# Altium project MQ_V1.0.0.PrjPcb
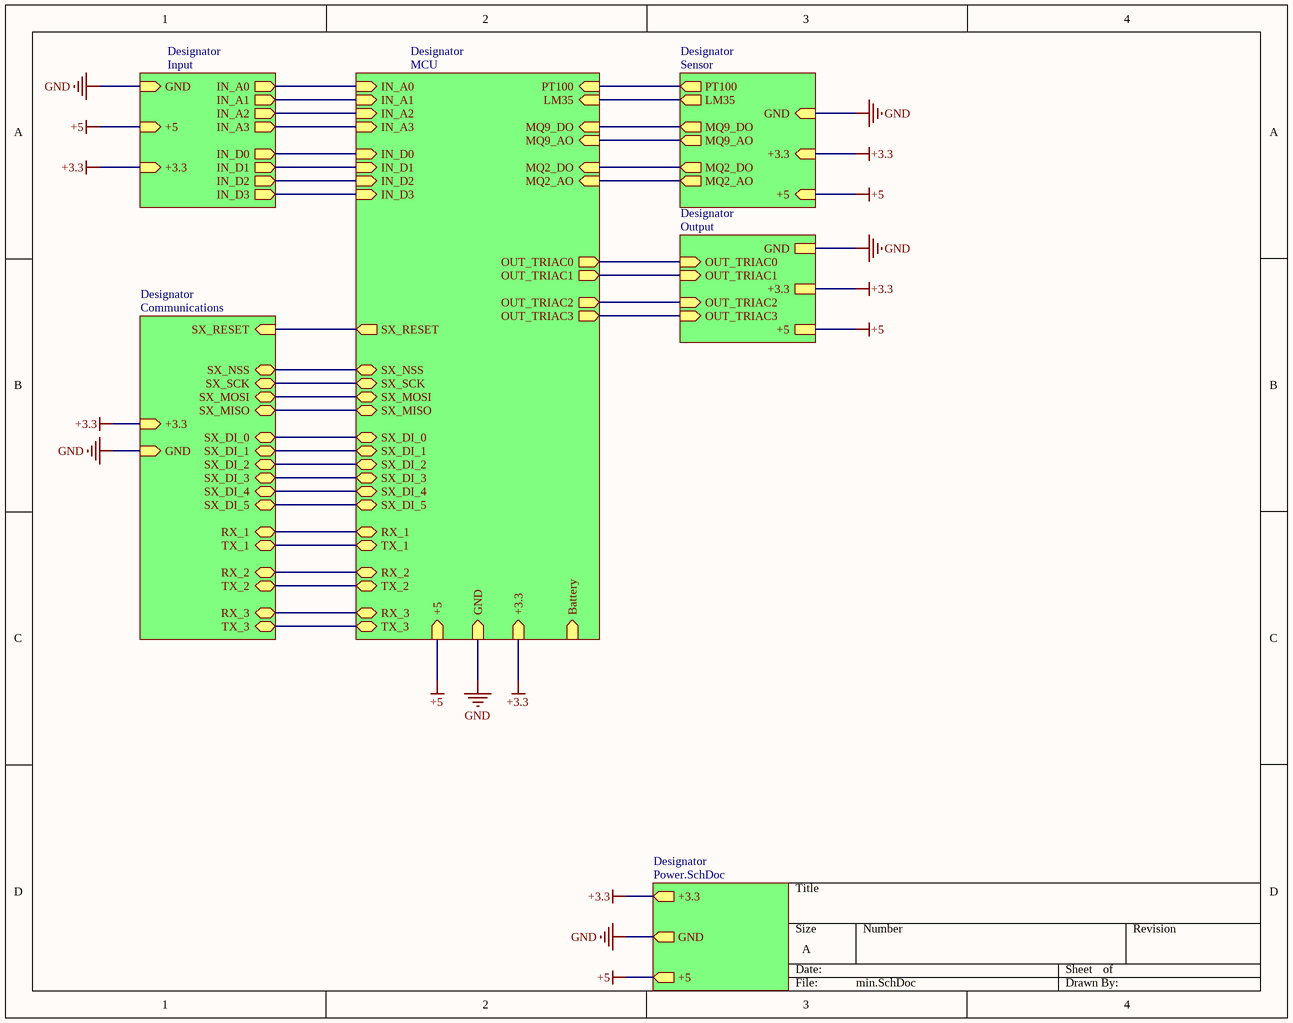
[diagram p0: min.SchDoc]
7 sheets, 158 parts. Net scope: hierarchical (ports join the sheet entries above them; power ports are global).
Board file: PCB1.PcbDoc
Sheets:
  min.SchDoc
    Designator = Input.SchDoc
    Designator = Power.SchDoc
    Designator = Sensor.SchDoc
    Designator = MCU.SchDoc
    Designator = Communications.SchDoc
    Designator = Output.SchDoc

## Sheet min.SchDoc
size A; SheetNumber: 1; SheetTotal: 7

### Sub-sheets
Designator = Input: IN_D0 (out), IN_D1 (out), IN_A0 (out), IN_A1 (out), GND (in), +5 (in), +3.3 (in), IN_A2 (out), IN_A3 (out), IN_D2 (out), IN_D3 (out)
Designator = Power.SchDoc: GND (out), +5 (out), +3.3 (out)
Designator = Sensor: +5 (in), GND (in), PT100 (out), LM35 (out), MQ9_DO (out), MQ9_AO (out), MQ2_DO (out), MQ2_AO (out), +3.3 (in)
Designator = MCU: +3.3 (in), GND (in), +5 (in), IN_D0 (in), IN_D1 (in), IN_A0 (in), IN_A1 (in), OUT_TRIAC1 (out), OUT_TRIAC0 (out), PT100 (in), LM35 (in), MQ9_DO (in), MQ9_AO (in), MQ2_DO (in), MQ2_AO (in), SX_RESET (out), SX_NSS (bidir), SX_SCK (bidir), SX_MOSI (bidir), SX_MISO (bidir), Battery (in), SX_DI_0 (bidir), SX_DI_1 (bidir), SX_DI_2 (bidir), SX_DI_3 (bidir), SX_DI_4 (bidir), SX_DI_5 (bidir), RX_2 (bidir), RX_3 (bidir), TX_3 (bidir), TX_2 (bidir), RX_1 (bidir), TX_1 (bidir), IN_A2 (in), IN_A3 (in), IN_D2 (in), IN_D3 (in), OUT_TRIAC2 (out), OUT_TRIAC3 (out)
Designator = Communications: SX_RESET (in), SX_NSS (bidir), SX_SCK (bidir), SX_MOSI (bidir), SX_MISO (bidir), +3.3 (in), GND (in), SX_DI_0 (bidir), SX_DI_1 (bidir), SX_DI_2 (bidir), SX_DI_3 (bidir), SX_DI_4 (bidir), SX_DI_5 (bidir), RX_1 (bidir), TX_1 (bidir), RX_2 (bidir), RX_3 (bidir), TX_2 (bidir), TX_3 (bidir)
Designator = Output: GND, +3.3, +5, OUT_TRIAC0 (in), OUT_TRIAC1 (in), OUT_TRIAC2 (in), OUT_TRIAC3 (in)

### Nets
+3.3: sheet Designator/+3.3, sheet Designator/+3.3, sheet Designator/+3.3, sheet Designator/+3.3, sheet Designator/+3.3, sheet Designator/+3.3
+5: sheet Designator/+5, sheet Designator/+5, sheet Designator/+5, sheet Designator/+5, sheet Designator/+5
GND: sheet Designator/GND, sheet Designator/GND, sheet Designator/GND, sheet Designator/GND, sheet Designator/GND, sheet Designator/GND
NetC2_2: sheet Designator/SX_RESET, sheet Designator/SX_RESET
NetC10_1: sheet Designator/MQ2_AO, sheet Designator/MQ2_AO
NetC11_1: sheet Designator/MQ9_AO, sheet Designator/MQ9_AO
NetC12_2: sheet Designator/LM35, sheet Designator/LM35
NetD2_2: sheet Designator/IN_A0, sheet Designator/IN_A0
NetD6_2: sheet Designator/IN_A1, sheet Designator/IN_A1
NetD9_2: sheet Designator/IN_A2, sheet Designator/IN_A2
NetD12_2: sheet Designator/IN_A3, sheet Designator/IN_A3
NetD26_2: sheet Designator/PT100, sheet Designator/PT100
NetJ1_1: sheet Designator/TX_2, sheet Designator/TX_2
NetJ1_2: sheet Designator/RX_2, sheet Designator/RX_2
NetJ2_1: sheet Designator/TX_3, sheet Designator/TX_3
NetJ2_2: sheet Designator/RX_3, sheet Designator/RX_3
NetJ3_1: sheet Designator/TX_1, sheet Designator/TX_1
NetJ3_2: sheet Designator/RX_1, sheet Designator/RX_1
NetJ15_3: sheet Designator/MQ9_DO, sheet Designator/MQ9_DO
NetJ16_3: sheet Designator/MQ2_DO, sheet Designator/MQ2_DO
NetR2_1: sheet Designator/SX_NSS, sheet Designator/SX_NSS
NetR3_1: sheet Designator/SX_SCK, sheet Designator/SX_SCK
NetR4_1: sheet Designator/SX_MOSI, sheet Designator/SX_MOSI
NetR5_1: sheet Designator/SX_MISO, sheet Designator/SX_MISO
NetR8_1: sheet Designator/IN_D0, sheet Designator/IN_D0
NetR17_2: sheet Designator/IN_D1, sheet Designator/IN_D1
NetR22_1: sheet Designator/IN_D2, sheet Designator/IN_D2
NetR31_2: sheet Designator/IN_D3, sheet Designator/IN_D3
NetR38_1: sheet Designator/OUT_TRIAC0, sheet Designator/OUT_TRIAC0
NetR40_1: sheet Designator/OUT_TRIAC1, sheet Designator/OUT_TRIAC1
NetR42_1: sheet Designator/OUT_TRIAC2, sheet Designator/OUT_TRIAC2
NetR44_1: sheet Designator/OUT_TRIAC3, sheet Designator/OUT_TRIAC3
NetU1_5: sheet Designator/SX_DI_0, sheet Designator/SX_DI_0
NetU1_6: sheet Designator/SX_DI_1, sheet Designator/SX_DI_1
NetU1_7: sheet Designator/SX_DI_2, sheet Designator/SX_DI_2
NetU1_8: sheet Designator/SX_DI_3, sheet Designator/SX_DI_3
NetU1_10: sheet Designator/SX_DI_4, sheet Designator/SX_DI_4
NetU1_11: sheet Designator/SX_DI_5, sheet Designator/SX_DI_5

## Sheet Input.SchDoc
size A; SheetNumber: 3; SheetTotal: 7
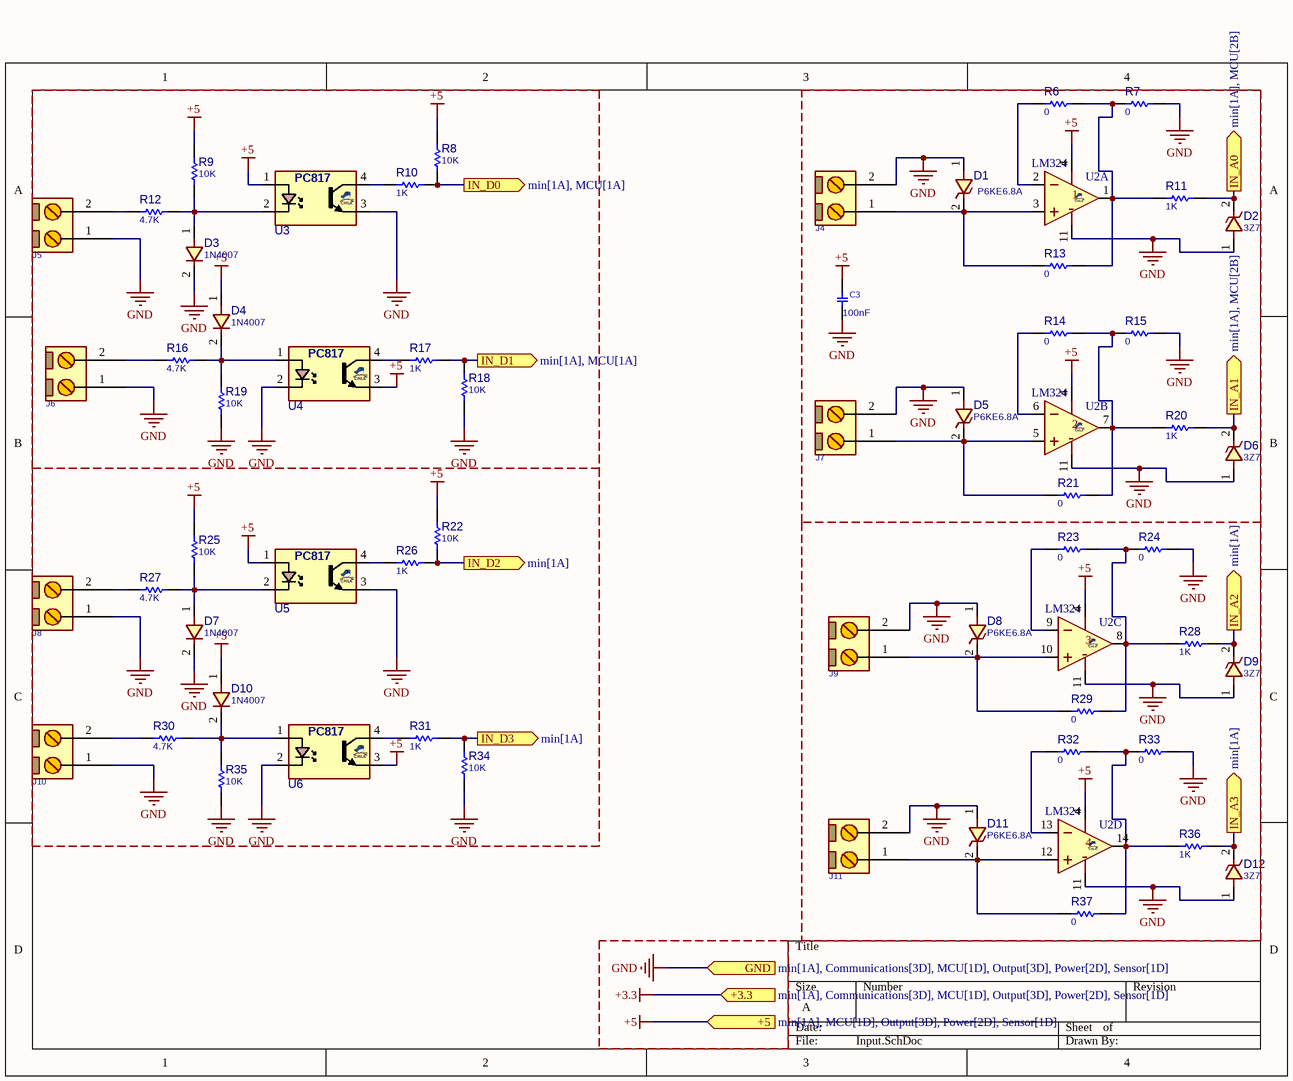
[diagram p1: Input.SchDoc]

### Parts
C3  100nF  [C1206]
D1  P6KE6.8A  [D_AX04_DO41]
D2  3Z7  [D_AX04_DO41]
D3  1N4007  [D_AX04_DO41]
D4  1N4007  [D_AX04_DO41]
D5  P6KE6.8A  [D_AX04_DO41]
D6  3Z7  [D_AX04_DO41]
D7  1N4007  [D_AX04_DO41]
D8  P6KE6.8A  [D_AX04_DO41]
D9  3Z7  [D_AX04_DO41]
D10  1N4007  [D_AX04_DO41]
D11  P6KE6.8A  [D_AX04_DO41]
D12  3Z7  [D_AX04_DO41]
J4  CONN_GMSTB2  [GMSTB762_2]  (value not drawn)
J5  CONN_GMSTB2  [GMSTB762_2]  (value not drawn)
J6  CONN_GMSTB2  [GMSTB762_2]  (value not drawn)
J7  CONN_GMSTB2  [GMSTB762_2]  (value not drawn)
J8  CONN_GMSTB2  [GMSTB762_2]  (value not drawn)
J9  CONN_GMSTB2  [GMSTB762_2]  (value not drawn)
J10  CONN_GMSTB2  [GMSTB762_2]  (value not drawn)
J11  CONN_GMSTB2  [GMSTB762_2]  (value not drawn)
R6  0  [R1206]
R7  0  [R1206]
R8  10K  [R1206]
R9  10K  [R1206]
R10  1K  [R1206]
R11  1K  [R1206]
R12  4.7K  [R1206]
R13  0  [R1206]
R14  0  [R1206]
R15  0  [R1206]
R16  4.7K  [R1206]
R17  1K  [R1206]
R18  10K  [R1206]
R19  10K  [R1206]
R20  1K  [R1206]
R21  0  [R1206]
R22  10K  [R1206]
R23  0  [R1206]
R24  0  [R1206]
R25  10K  [R1206]
R26  1K  [R1206]
R27  4.7K  [R1206]
R28  1K  [R1206]
R29  0  [R1206]
R30  4.7K  [R1206]
R31  1K  [R1206]
R32  0  [R1206]
R33  0  [R1206]
R34  10K  [R1206]
R35  10K  [R1206]
R36  1K  [R1206]
R37  0  [R1206]
U2  LM324  [DIP_14]  (parts A,B,C,D of 4)
U3  PC817  [DIP_4]  (value not drawn)
U4  PC817  [DIP_4]  (value not drawn)
U5  PC817  [DIP_4]  (value not drawn)
U6  PC817  [DIP_4]  (value not drawn)

### Ports
+3.3 (in, see min[1A], Communications[3D], MCU[1D], Output[3D], Power[2D], Sensor[1D]), +5 (in, see min[1A], MCU[1D], Output[3D], Power[2D], Sensor[1D]), GND (in, see min[1A], Communications[3D], MCU[1D], Output[3D], Power[2D], Sensor[1D]), IN_A0 (out, see min[1A], MCU[2B]), IN_A1 (out, see min[1A], MCU[2B]), IN_A2 (out, see min[1A]), IN_A3 (out, see min[1A]), IN_D0 (out, see min[1A], MCU[1A]), IN_D1 (out, see min[1A], MCU[1A]), IN_D2 (out, see min[1A]), IN_D3 (out, see min[1A])

### Nets
+5: C3.1 D4.1 D10.1 R8.2 R9.2 R22.2 R25.2 U2.4(V+) U3.1(A) U4.3(E) U5.1(A) U6.3(E) ; port +5
GND: C3.2 D1.1 D2.1 D3.2 D5.1 D6.1 D7.2 D8.1 D9.1 D11.1 D12.1 J4.2 J5.1 J6.1 J7.2 J8.1 J9.2 J10.1 J11.2 R7.1 R15.1 R18.1 R19.1 R24.1 R33.1 R34.1 R35.1 U2.11(V-) U3.3(E) U4.2(K) U5.3(E) U6.2(K) ; port GND
NetD1_2: D1.2 J4.1 R13.2 U2.3(IN+)
NetD2_2: D2.2 R11.2 ; port IN_A0
NetD3_1: D3.1 R9.1 R12.1 U3.2(K)
NetD4_2: D4.2 R16.1 R19.2 U4.1(A)
NetD5_2: D5.2 J7.1 R21.2 U2.5(IN+)
NetD6_2: D6.2 R20.2 ; port IN_A1
NetD7_1: D7.1 R25.1 R27.1 U5.2(K)
NetD8_2: D8.2 J9.1 R29.2 U2.10(IN+)
NetD9_2: D9.2 R28.2 ; port IN_A2
NetD10_2: D10.2 R30.1 R35.2 U6.1(A)
NetD11_2: D11.2 J11.1 R37.2 U2.12(IN+)
NetD12_2: D12.2 R36.2 ; port IN_A3
NetJ5_2: J5.2 R12.2
NetJ6_2: J6.2 R16.2
NetJ8_2: J8.2 R27.2
NetJ10_2: J10.2 R30.2
NetR6_1: R6.1 R7.2 R11.1 R13.1 U2.1(OUT)
NetR6_2: R6.2 U2.2(IN-)
NetR8_1: R8.1 R10.2 ; port IN_D0
NetR10_1: R10.1 U3.4(C)
NetR14_1: R14.1 R15.2 R20.1 R21.1 U2.7(OUT)
NetR14_2: R14.2 U2.6(IN-)
NetR17_1: R17.1 U4.4(C)
NetR17_2: R17.2 R18.2 ; port IN_D1
NetR22_1: R22.1 R26.2 ; port IN_D2
NetR23_1: R23.1 R24.2 R28.1 R29.1 U2.8(OUT)
NetR23_2: R23.2 U2.9(IN-)
NetR26_1: R26.1 U5.4(C)
NetR31_1: R31.1 U6.4(C)
NetR31_2: R31.2 R34.2 ; port IN_D3
NetR32_1: R32.1 R33.2 R36.1 R37.1 U2.14(OUT)
NetR32_2: R32.2 U2.13(IN-)

### Library data of the parts
C3 = CAP_SMD_MLCC: CAP, MLCC; PARAM: C0G, 10%; DESC: CAP, MLCC, 1nF, 50V, C0G, 10%, 0402; MANF_P#: MANF_PART#; MANF: Murata; PARAM2: 50V; VALUE: 20pF; PRICE: 100= 1$; ASSEMBLY: ASSEMBLY
D1 D2 D5 D6 D8 D9 D11 D12 = DIODE_THD_ZENER: DIODE, ZENER, 0.2W, 15V; MANF: Diodes; DESC: DESCRIPTION; MANF_P#: ZENER15V; ASSEMBLY: ASSEMBLY; PRICE: PRICE; PARAM2: 0.2W; PARAM: 15V
  D1 D5 D8 D11: VALUE: P6KE6.8A
  D2 D6 D9 D12: VALUE: 3Z7
D3 D4 D7 D10 = DIODE_THD_1N4007: DIODE, GENERAL PURPOSE, 1000V/1A; MANF: Diodes; DESC: DESCRIPTION; PARAM: 1000V, 1.15V; PARAM2: 1.5A; ASSEMBLY: ASSEMBLY; PRICE: PRICE; MANF_P#: 1N4007; VALUE: 1N4007
J4-J11 = CONN_GMSTB762_2: CONN, PHOENIX GMSTB, 7.62mm pitch; MANF_P#: GMSTB 2,5/2-G-7,62; PARAM2: 630V; PARAM: 12A; VALUE: CONN_GMSTB2
R6-R37 = RES_SMD: RESISTOR, SMD; PARAM: -W; DESC: DESCRIPTION; DIST#: MOUSER; PARAM2: 1%; VALUE: 470; MANF_P#: -; MANF: -; ASSEMBLY: ASSEMBLY; PRICE: 100= 0.5$
U2 = LM324_DIP14: AMP, Quad, Single-Supply; MANF: ON, Texas Instruments, ST; MANF_P#: LM324AN; VALUE: LM324
U3-U6 = OPTC_TR4P_PC817: OPTOCOUPLER, TRANSISTOR, 4PIN; PARAM: IF=20mA; PARAM2: VCE = 35V; MANF: SHARP; MANF_P#: PC817; PRICE: -; VALUE: PC817; PACKAGE: DIP-4

## Sheet Power.SchDoc
size A; SheetNumber: 5; SheetTotal: 7
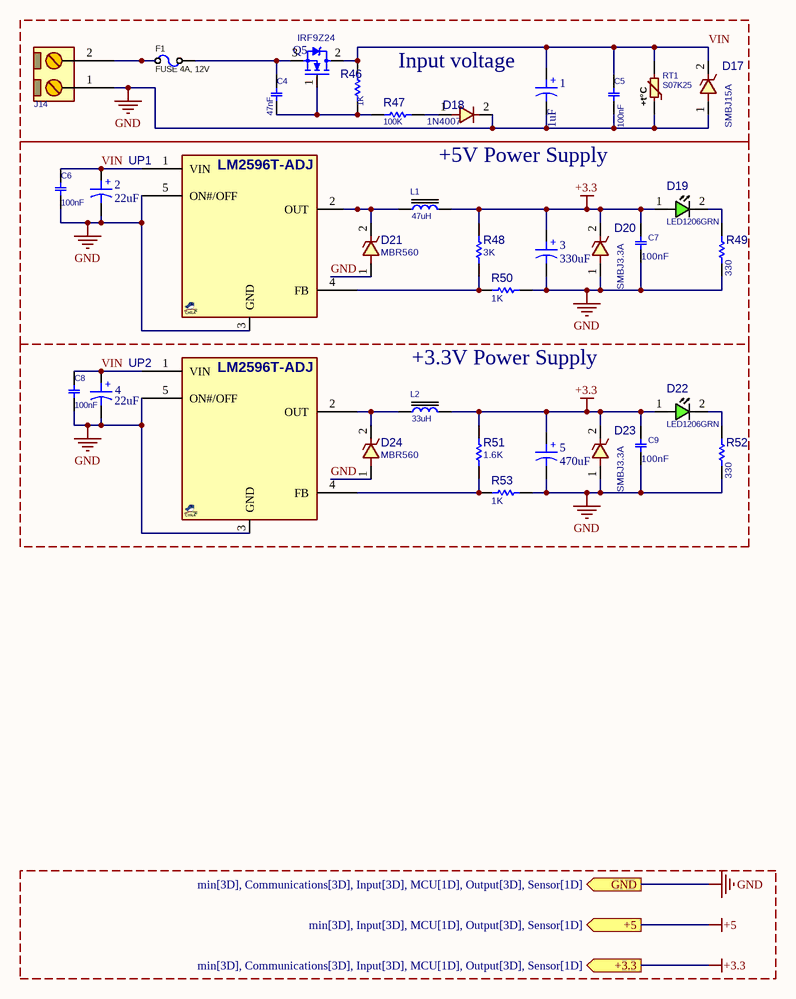
[diagram p2: Power.SchDoc]

### Parts
1  1uF  [Cap electrolitic radial 10x20-5]
2  22uF  [Cap electrolitic radial 10x20-5]
3  330uF  [Cap electrolitic radial 10x20-5]
4  22uF  [Cap electrolitic radial 10x20-5]
5  470uF  [Cap electrolitic radial 10x20-5]
C4  47nF  [C_CERM_D3]
C5  100nF  [C_CERM_D3]
C6  100nF  [C_CERM_D3]
C7  100nF  [C1206]
C8  100nF  [C_CERM_D3]
C9  100nF  [C1206]
D17  SMBJ15A  [D_SMB]
D18  1N4007  [D_AX03_1WS]
D19  LED1206GRN  [LED1206GRN]
D20  SMBJ3.3A  [D_SMB]
D21  MBR560  [D_AX04_DO41]
D22  LED1206GRN  [LED1206GRN]
D23  SMBJ3.3A  [D_SMB]
D24  MBR560  [D_AX04_DO41]
F1  FUSE 4A, 12V  [FUSH_6X32MM_4PIN]
J14  CONN_TB2  [TBB_2]  (value not drawn)
L1  47uH  [L_7]
L2  33uH  [L_7]
Q5  IRF9Z24  [TO247_3]
R46  1K  [R0125W_AX03]
R47  100K  [R0125W_AX03]
R48  3K  [R1206]
R49  330  [R1206]
R50  1K  [R1206]
R51  1.6K  [R1206]
R52  330  [R1206]
R53  1K  [R1206]
RT1  S07K25  [NTC_15X6]
UP1  LM2596T-ADJ  [TO220_5]  (value not drawn)
UP2  LM2596T-ADJ  [TO220_5]  (value not drawn)

### Ports
+3.3 (out, see min[3D], Communications[3D], Input[3D], MCU[1D], Output[3D], Sensor[1D]), +5 (out, see min[3D], Input[3D], MCU[1D], Output[3D], Sensor[1D]), GND (out, see min[3D], Communications[3D], Input[3D], MCU[1D], Output[3D], Sensor[1D])

### Nets
+3.3: 3.1 5.1 C7.1 C9.1 D19.1(ANODE) D20.2 D22.1(ANODE) D23.2 L1.2 L2.2 R48.1 R51.2 ; port +3.3
GND: 1.2 2.2 3.2 4.2 5.2 C5.1 C6.1 C7.2 C8.1 C9.2 D17.1 D18.2 D20.1 D21.1 D23.1 D24.1 J14.1 R49.2 R50.2 R52.2 R53.2 RT1.1 UP1.3(GND) UP1.5(ON#/OFF) UP2.3(GND) UP2.5(ON#/OFF) ; port GND
VIN: 1.1 2.1 4.1 C5.2 C6.2 C8.2 D17.2 Q5.2(D) R46.2 RT1.2 UP1.1(VIN) UP2.1(VIN)
NetC4_1: C4.1 Q5.1(G) R46.1 R47.1
NetC4_2: C4.2 F1.2 Q5.3(S)
NetD18_1: D18.1 R47.2
NetD19_2: D19.2(CATHODE) R49.1
NetD21_2: D21.2 L1.1 UP1.2(OUT)
NetD22_2: D22.2(CATHODE) R52.1
NetD24_2: D24.2 L2.1 UP2.2(OUT)
NetF1_1: F1.1 J14.2
NetR48_2: R48.2 R50.1 UP1.4(FB)
NetR51_1: R51.1 R53.1 UP2.4(FB)

### Notes on the sheet
- (near 1) Input voltage
- +5V Power Supply
- +3.3V Power Supply
- (in symbol Cap electrolitic radial 10x21) +
- (in symbol PTC10K) +t°C

### Library data of the parts
1-5 = Cap electrolitic radial 10x21: Cap electrolitic radial; Part. No: 100U/50V; Designer: Abbas Basereh; Data: 16-12-2016
C4-C6 C8 = CAP_THD_CER: CAP, THD, CER MULTI LAYER,; DESC: CAP, CER MULTI LAYER,; MANF_P#: MANF_PART#; PARAM2: 50V; VALUE: 470pF; PRICE: 100= 1$; MANF: MANF; ASSEMBLY: ASSEMBLY
C7 C9 = CAP_SMD_MLCC: as C3 on sheet Input; PRICE: 100= 1$; ASSEMBLY: ASSEMBLY
D17 D20 D23 = DIODE_SMD_ZENER_Z2SMB36: DIODE, ZENER, 2W, 36V; MANF: Diotec; DESC: DESCRIPTION; PARAM: 2W, 16Ohm, -50~150°C; ASSEMBLY: ASSEMBLY; PRICE: -; PARAM2: 36V; MANF_P#: Z2SMB36
  D17: VALUE: SMBJ15A
  D20 D23: VALUE: SMBJ3.3A
D18 = DIODE_THD_1N4007: as D3 on sheet Input; ASSEMBLY: ASSEMBLY; PRICE: PRICE; MANF_P#: 1N4007; VALUE: 1N4007
D19 D22 = LED_SMD_1206_GRN: LED, SMD, 1206, GREEN; PARAM: 20mA; DESC: DESCRIPTION; PARAM2: 2.2V; MANF: -; ASSEMBLY: ASSEMBLY; PRICE: 36t@Javan; MANF_P#: -; VALUE: LED1206GRN
D21 D24 = DIODE_THD_ZENER: as D1 on sheet Input; ASSEMBLY: ASSEMBLY; PRICE: PRICE; PARAM2: 0.2W; PARAM: 15V; VALUE: MBR560
F1 = FUSE_6X32: Fuse HOLDER 5X20; PARAM: 30A; MANF_P#: MANF_PART#; PARAM2: 125VAC; MANF: MANF; VALUE: FUSE 4A, 12V
J14 = CONN_TB2: CONN, TERMINAL BLOCK, 5.08mm pitch; VALUE: CONN_TB2
L1 L2 = IND_SMD_10uH_2A: INDUCTOR, 10uH 2A, 38mOhm, 2626; PARAM: 2A Irms, 2.05A Isat; MANF_P#: SRR6038-100Y; MANF: Bourns; PRICE: 2.5$; DESC: INDUCTOR, 10uH 2A, 38mOhm, 2626; PARAM2: 38mOhm; ASSEMBLY: ASSEMBLY; VALUE: 10uH
Q5 = MOSN_IRFP: MANF_P#: IRFP; ASSEMBLY: ASSEMBLY; VALUE: IRF9Z24
R46 R47 = RES_THD: RESISTOR, THD; MANF_P#: RK73H1ETTP4701F; MANF: KOA SPEER; PARAM: 0.063W; DESC: DESCRIPTION; DIST#: MOUSER; PARAM2: 1%; VALUE: 0; ASSEMBLY: ASSEMBLY; PRICE: 100= 0.5$
R48-R53 = RES_SMD: as R6 on sheet Input; MANF_P#: -; MANF: -; ASSEMBLY: ASSEMBLY; PRICE: 100= 0.5$
RT1 = PTC10K: Thermistor, NTC; MANF_P#: PTC; PARAM: 10K; MANF: -; PARAM2: -; PRICE: -; VALUE: S07K25
UP1 UP2 = VREG_LM2596T-ADJ_TO220: REG, Switching, Buck, 3A, ADJ, 150KHz, TO-220; MANF: TI, ON, TS; PARAM: 3A, ADJ; PARAM2: 150KHz, 40VIN; ASSEMBLY: ASSEMBLY; PRICE: PRICE; DESC: REG, Switching, Buck, 3A, ADJ, 150KHz, TO-220; MANF_P#: LM2596T-ADJ; VALUE: LM2596T-ADJ; PACKAGE: TO-220-5

## Sheet Sensor.SchDoc
size A; SheetNumber: 6; SheetTotal: 7
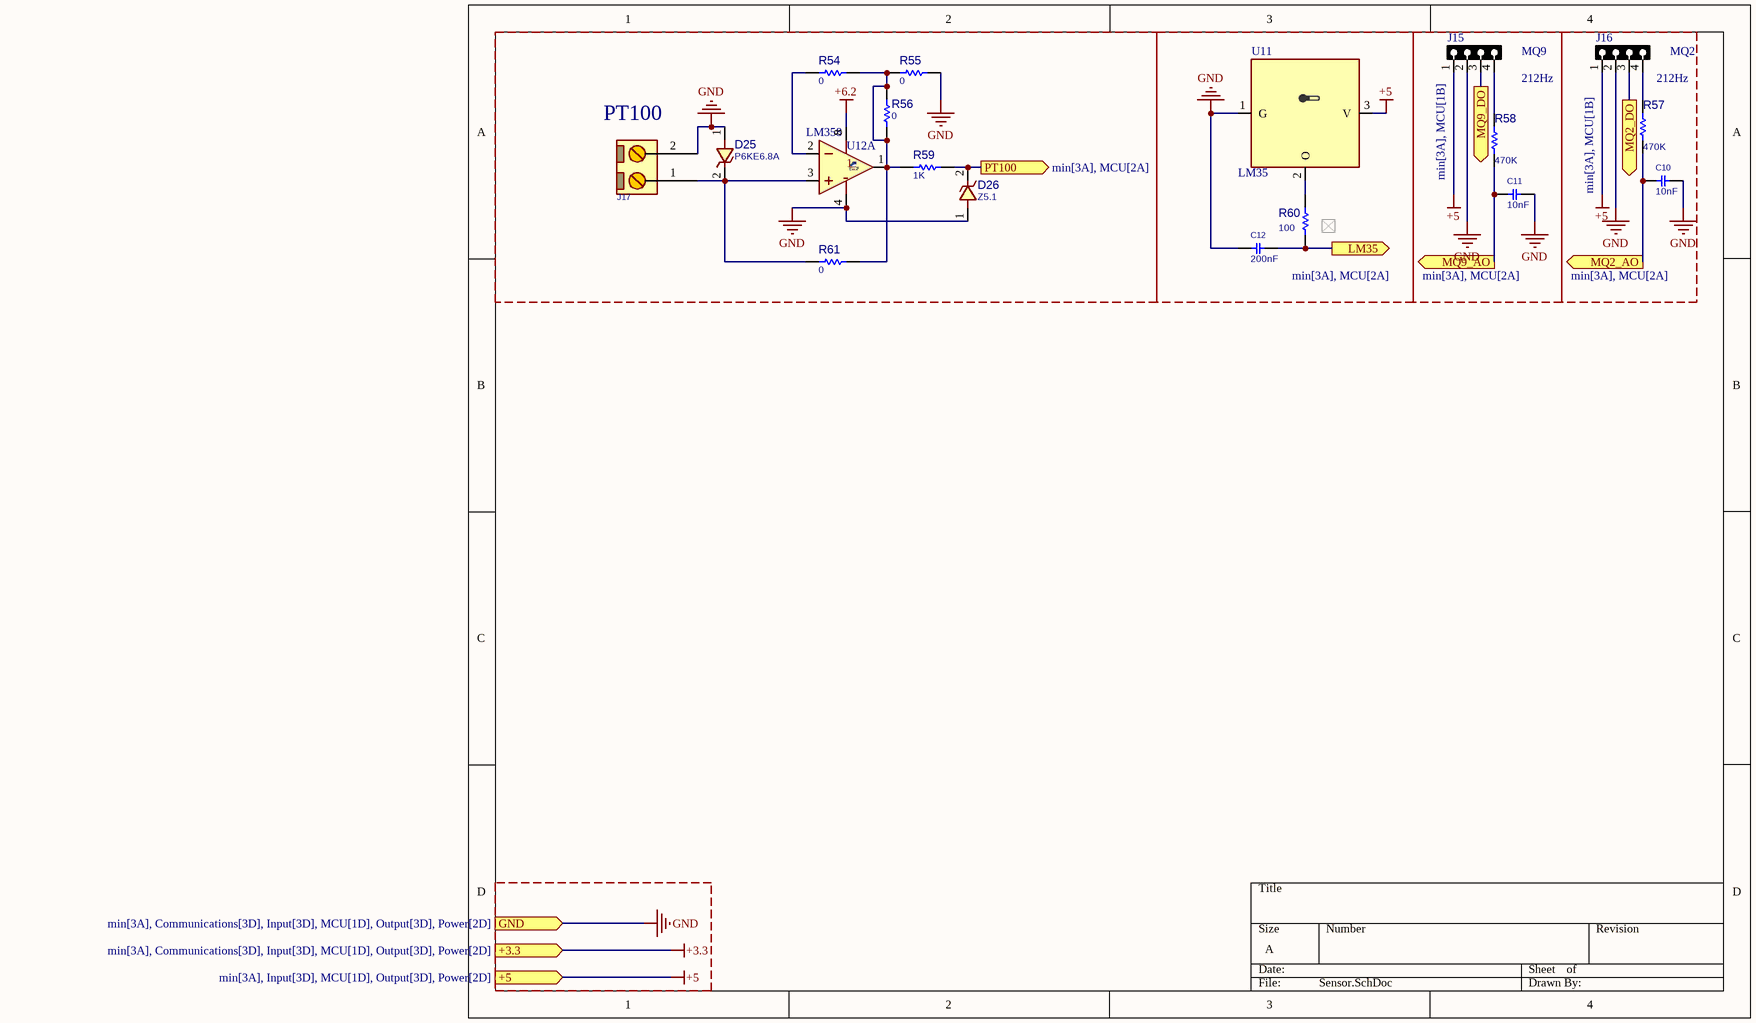
[diagram p3: Sensor.SchDoc]

### Parts
C10  10nF  [C1206]
C11  10nF  [C1206]
C12  200nF  [C1206]
D25  P6KE6.8A  [D_AX04_DO41]
D26  Z5.1  [D_AX04_DO41]
J15  MQ9  [HDR_F_1X4]
J16  MQ2  [HDR_F_1X4]
J17  CONN_GMSTB2  [GMSTB762_2]  (value not drawn)
R54  0  [R1206]
R55  0  [R1206]
R56  0  [R1206]
R57  470K  [R1206]
R58  470K  [R1206]
R59  1K  [R1206]
R60  100  [R1206]
R61  0  [R1206]
U11  LM35  [TO92_3]
U12  LM358  [DIP_8]  (part A of 2)

### Ports
+3.3 (in, see min[3A], Communications[3D], Input[3D], MCU[1D], Output[3D], Power[2D]), +5 (in, see min[3A], Input[3D], MCU[1D], Output[3D], Power[2D]), GND (in, see min[3A], Communications[3D], Input[3D], MCU[1D], Output[3D], Power[2D]), LM35 (out, see min[3A], MCU[2A]), MQ2_AO (out, see min[3A], MCU[2A]), MQ2_DO (out, see min[3A], MCU[1B]), MQ9_AO (out, see min[3A], MCU[2A]), MQ9_DO (out, see min[3A], MCU[1B]), PT100 (out, see min[3A], MCU[2A])

### Nets
+5: J15.1 J16.1 U11.3(V) ; port +5
+6.2: U12.8(V+)
GND: C10.2 C11.2 C12.1 D25.1 D26.1 J15.2 J16.2 J17.2 R55.1 U11.1(G) U12.4(V-) ; port GND
NetC10_1: C10.1 R57.1 ; port MQ2_AO
NetC11_1: C11.1 R58.1 ; port MQ9_AO
NetC12_2: C12.2 R60.1 ; port LM35
NetD25_2: D25.2 J17.1 R61.2 U12.3(IN+)
NetD26_2: D26.2 R59.2 ; port PT100
NetJ15_3: J15.3 ; port MQ9_DO
NetJ15_4: J15.4 R58.2
NetJ16_3: J16.3 ; port MQ2_DO
NetJ16_4: J16.4 R57.2
NetR54_1: R54.1 R55.2 R56.1 R56.2 R59.1 R61.1 U12.1(OUT)
NetR54_2: R54.2 U12.2(IN-)
NetR60_2: R60.2 U11.2(O)

### Notes on the sheet
- 212Hz
- (near J17) PT100

### Library data of the parts
C10-C12 = CAP_SMD_MLCC: as C3 on sheet Input; PRICE: 100= 1$; ASSEMBLY: ASSEMBLY
D25 D26 = DIODE_THD_ZENER: as D1 on sheet Input; ASSEMBLY: ASSEMBLY; PRICE: PRICE; PARAM2: 0.2W; PARAM: 15V
  D25: VALUE: P6KE6.8A
  D26: VALUE: Z5.1
J15 J16 = HDR_F_1X4: CONN, HEADER, Female, pitch: 2.54mm, 4POS; VALUE: HDRF4
J17 = CONN_GMSTB762_2: as J4 on sheet Input; VALUE: CONN_GMSTB2
R54-R61 = RES_SMD: as R6 on sheet Input; MANF_P#: -; MANF: -; ASSEMBLY: ASSEMBLY; PRICE: 100= 0.5$
U11 = TMP_LM35_TO92: SENSOR, TEMP, ANALOG, -55~150oC, 4~20Vcc, Out 0mV + 10mV/oC; MANF_P#: LM35CZ, LM35CAZ or LM35DZ; MANF: TI; PARAM: 0.5°C Accuracy, 10mV/oC, -55~150oC; PARAM2: 4~20Vcc; PRICE: 7$; VALUE: LM35
U12 = LM358_DIP8: AMP, Dual, Low-Power; MANF: Texas Instruments, Fairchild; MANF_P#: LM358AN; PARAM2: 3 V ~ 32 V, ±1.5 V ~ 16 V; PRICE: -; VALUE: LM358

## Sheet MCU.SchDoc
size A; SheetNumber: 7; SheetTotal: 7
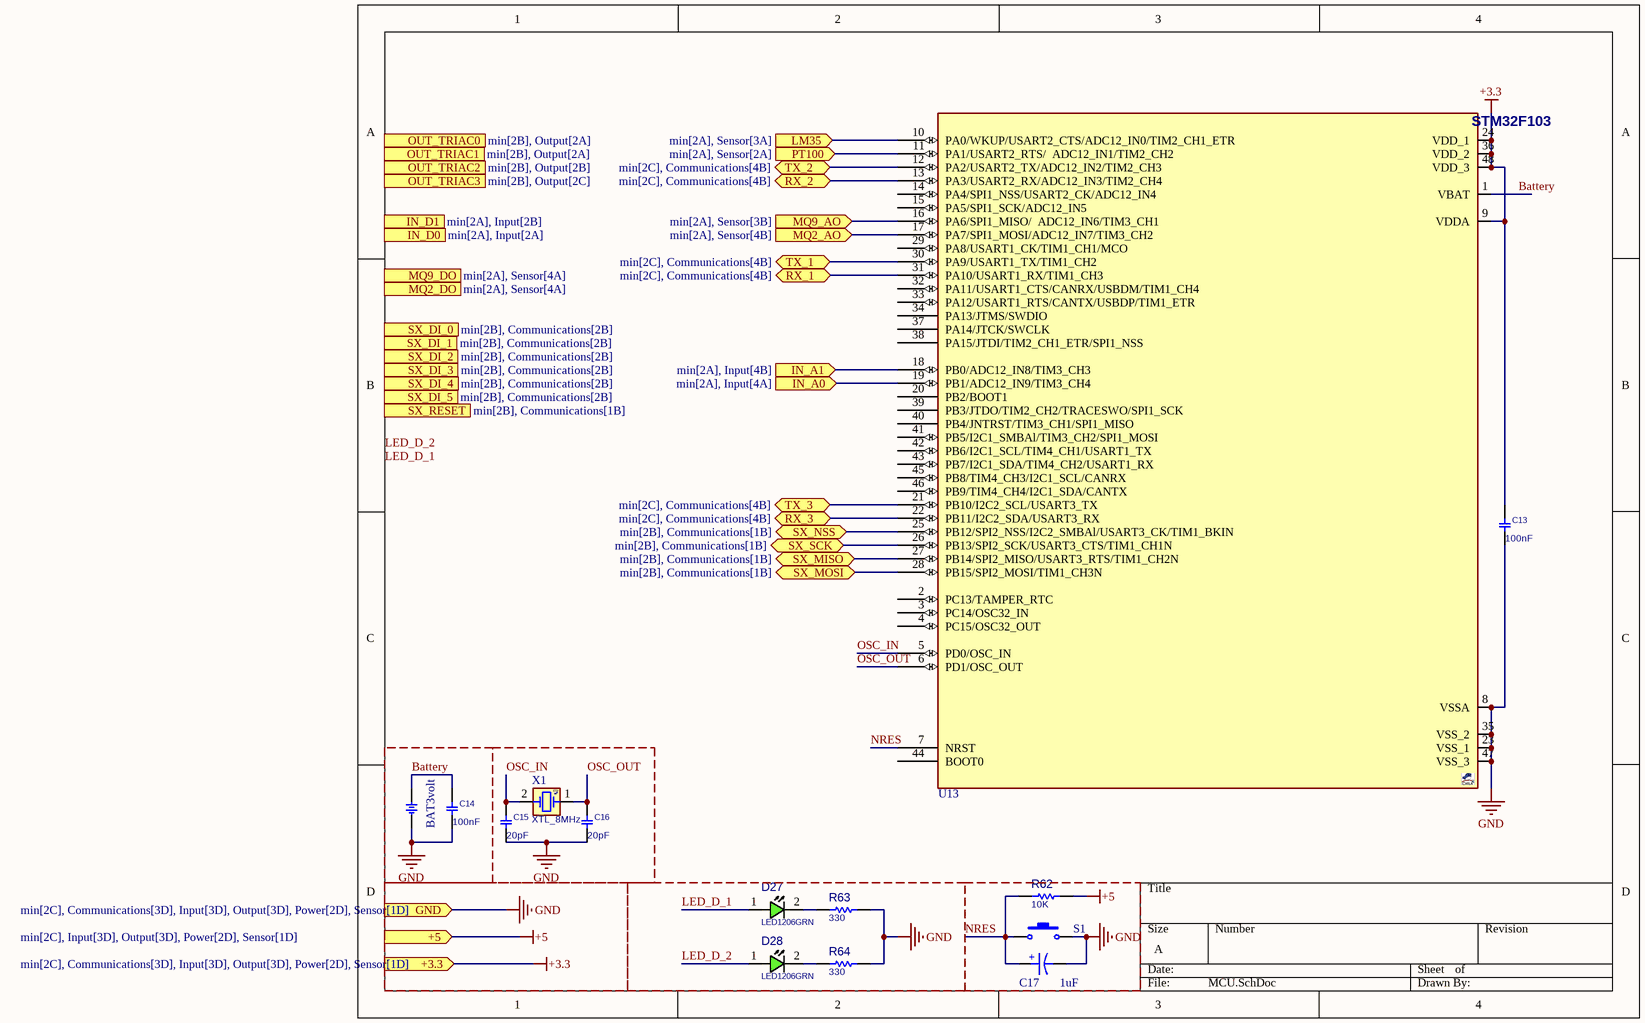
[diagram p4: MCU.SchDoc]

### Parts
BT1  BAT3volt  [BTH1632_BH600]
C13  100nF  [C1206]
C14  100nF  [C1206]
C15  20pF  [C1206]
C16  20pF  [C1206]
C17  1uF  [Cap electrolitic radial 10x20-5]
D27  LED1206GRN  [LED1206GRN]
D28  LED1206GRN  [LED1206GRN]
R62  10K  [R1206]
R63  330  [R1206]
R64  330  [R1206]
S1  Switch PB  [Switch - Push to On]  (value not drawn)
U13  STM32F103  [QFG50_48]  (value not drawn)
X1  XTL_8MHz  [XTL_2_11X5]

### Ports
+3.3 (in, see min[2C], Communications[3D], Input[3D], Output[3D], Power[2D], Sensor[1D]), +5 (in, see min[2C], Input[3D], Output[3D], Power[2D], Sensor[1D]), GND (in, see min[2C], Communications[3D], Input[3D], Output[3D], Power[2D], Sensor[1D]), IN_A0 (in, see min[2A], Input[4A]), IN_A1 (in, see min[2A], Input[4B]), IN_D0 (in, see min[2A], Input[2A]), IN_D1 (in, see min[2A], Input[2B]), LM35 (in, see min[2A], Sensor[3A]), MQ2_AO (in, see min[2A], Sensor[4B]), MQ2_DO (in, see min[2A], Sensor[4A]), MQ9_AO (in, see min[2A], Sensor[3B]), MQ9_DO (in, see min[2A], Sensor[4A]), OUT_TRIAC0 (out, see min[2B], Output[2A]), OUT_TRIAC1 (out, see min[2B], Output[2A]), OUT_TRIAC2 (out, see min[2B], Output[2B]), OUT_TRIAC3 (out, see min[2B], Output[2C]), PT100 (in, see min[2A], Sensor[2A]), RX_1 (bidir, see min[2C], Communications[4B]), RX_2 (bidir, see min[2C], Communications[4B]), RX_3 (bidir, see min[2C], Communications[4B]), SX_DI_0 (in, see min[2B], Communications[2B]), SX_DI_1 (in, see min[2B], Communications[2B]), SX_DI_2 (in, see min[2B], Communications[2B]), SX_DI_3 (in, see min[2B], Communications[2B]), SX_DI_4 (in, see min[2B], Communications[2B]), SX_DI_5 (in, see min[2B], Communications[2B]), SX_MISO (bidir, see min[2B], Communications[1B]), SX_MOSI (bidir, see min[2B], Communications[1B]), SX_NSS (bidir, see min[2B], Communications[1B]), SX_RESET (out, see min[2B], Communications[1B]), SX_SCK (bidir, see min[2B], Communications[1B]), TX_1 (bidir, see min[2C], Communications[4B]), TX_2 (bidir, see min[2C], Communications[4B]), TX_3 (bidir, see min[2C], Communications[4B])

### Nets
+3.3: C13.1 U13.9(VDDA) U13.24(VDD_1) U13.36(VDD_2) U13.48(VDD_3) ; port +3.3
+5: R62.2 ; port +5
GND: BT1.2 C13.2 C14.2 C15.2 C16.2 C17.2 R63.2 R64.2 S1.2 U13.8(VSSA) U13.23(VSS_1) U13.35(VSS_2) U13.47(VSS_3) ; port GND
Battery: BT1.1 C14.1 U13.1(VBAT)
LED_D_1: D27.1(ANODE)
LED_D_2: D28.1(ANODE)
NRES: C17.1 R62.1 S1.1 U13.7(NRST)
OSC_IN: C15.1 U13.5(PD0/OSC_IN) X1.2(OSC2)
OSC_OUT: C16.1 U13.6(PD1/OSC_OUT) X1.1(OSC1)
NetC10_1: U13.17(PA7/SPI1_MOSI/ADC12_IN7/TIM3_CH2) ; port MQ2_AO
NetC11_1: U13.16(PA6/SPI1_MISO/__ADC12_IN6/TIM3_CH1) ; port MQ9_AO
NetC12_2: U13.10(PA0/WKUP/USART2_CTS/ADC12_IN0/TIM2_CH1_ETR) ; port LM35
NetD2_2: U13.19(PB1/ADC12_IN9/TIM3_CH4) ; port IN_A0
NetD6_2: U13.18(PB0/ADC12_IN8/TIM3_CH3) ; port IN_A1
NetD26_2: U13.11(PA1/USART2_RTS/__ADC12_IN1/TIM2_CH2) ; port PT100
NetD27_2: D27.2(CATHODE) R63.1
NetD28_2: D28.2(CATHODE) R64.1
NetJ1_1: U13.12(PA2/USART2_TX/ADC12_IN2/TIM2_CH3) ; port TX_2
NetJ1_2: U13.13(PA3/USART2_RX/ADC12_IN3/TIM2_CH4) ; port RX_2
NetJ2_1: U13.21(PB10/I2C2_SCL/USART3_TX) ; port TX_3
NetJ2_2: U13.22(PB11/I2C2_SDA/USART3_RX) ; port RX_3
NetJ3_1: U13.30(PA9/USART1_TX/TIM1_CH2) ; port TX_1
NetJ3_2: U13.31(PA10/USART1_RX/TIM1_CH3) ; port RX_1
NetR2_1: U13.25(PB12/SPI2_NSS/I2C2_SMBAl/USART3_CK/TIM1_BKIN) ; port SX_NSS
NetR3_1: U13.26(PB13/SPI2_SCK/USART3_CTS/TIM1_CH1N) ; port SX_SCK
NetR4_1: U13.28(PB15/SPI2_MOSI/TIM1_CH3N) ; port SX_MOSI
NetR5_1: U13.27(PB14/SPI2_MISO/USART3_RTS/TIM1_CH2N) ; port SX_MISO

Not connected (* = marked no-connect by the designer): U13 2(PC13/TAMPER_RTC) 3(PC14/OSC32_IN) 4(PC15/OSC32_OUT) 14(PA4/SPI1_NSS/USART2_CK/ADC12_IN4) 15(PA5/SPI1_SCK/ADC12_IN5) 20(PB2/BOOT1) 29(PA8/USART1_CK/TIM1_CH1/MCO) 32(PA11/USART1_CTS/CANRX/USBDM/TIM1_CH4) 33(PA12/USART1_RTS/CANTX/USBDP/TIM1_ETR) 34(PA13/JTMS/SWDIO) 37(PA14/JTCK/SWCLK) 38(PA15/JTDI/TIM2_CH1_ETR/SPI1_NSS) 39(PB3/JTDO/TIM2_CH2/TRACESWO/SPI1_SCK) 40(PB4/JNTRST/TIM3_CH1/SPI1_MISO) 41(PB5/I2C1_SMBAl/TIM3_CH2/SPI1_MOSI) 42(PB6/I2C1_SCL/TIM4_CH1/USART1_TX) 43(PB7/I2C1_SDA/TIM4_CH2/USART1_RX) 44(BOOT0) 45(PB8/TIM4_CH3/I2C1_SCL/CANRX) 46(PB9/TIM4_CH4/I2C1_SDA/CANTX)

### Notes on the sheet
- Labels drawn without touching a wire or pin: LED_D_1, LED_D_2
- (in symbol Cap electrolitic radial 10x21) +

### Library data of the parts
BT1 = BATH_CR1632: BATTERY HOLDER, CR1632 CR1620 CR1616; MANF_P#: BH600; .: http://www.chila.ir; VALUE: BAT3volt
C13 C14 = CAP_SMD_MLCC: as C3 on sheet Input; PRICE: 100= 1$; ASSEMBLY: ASSEMBLY
C15 C16 = CAP_SMD_MLCC: CAP, MLCC; PARAM: C0G, 10%; DESC: CAP, MLCC, 1nF, 50V, C0G, 10%, 0402; MANF_P#: MANF_PART#; MANF: Murata; PARAM2: 50V; PRICE: 100= 1$; ASSEMBLY: ASSEMBLY; VALUE: 20pF
C17 = Cap electrolitic radial 10x21: as 1 on sheet Power; Data: 16-12-2016
D27 D28 = LED_SMD_1206_GRN: as D19 on sheet Power; MANF: -; ASSEMBLY: ASSEMBLY; PRICE: 36t@Javan; MANF_P#: -; VALUE: LED1206GRN
R62-R64 = RES_SMD: as R6 on sheet Input; MANF_P#: -; MANF: -; ASSEMBLY: ASSEMBLY; PRICE: 100= 0.5$
S1 = Switch PB: Push Button Switch
U13 = STM32F103C8T6_QFP48: MCU, STM32 ARM 32-bit, Cortex M3, 64KB FLASH, 20KB SRAM; DESC: CAN, I2C, SPI, USART, USB; MANF: ST; PARAM2: 2~3.6VCC, 72MHz, 2X12Bit ADC; PARAM: 64KB FLASH, 20KB SRAM, -40~85oC; MANF_P#: STM32F103C8T6; PRICE: 6$; VALUE: STM32F103; PACKAGE: QFP-48
X1 = XTL_2_HC49_8MHz_SMD: Crystal MOST POPULAR ABL HC49 PACKAGE; MANF: ABRACON; MANF_P#: ABLS-8.000MHZ-B4-T; PARAM: 8MHz, 18pF, 30PPM, -20~70oC; PRICE: 0.3$; VALUE: XTL_8MHz

## Sheet Communications.SchDoc
size A; SheetNumber: 2; SheetTotal: 7
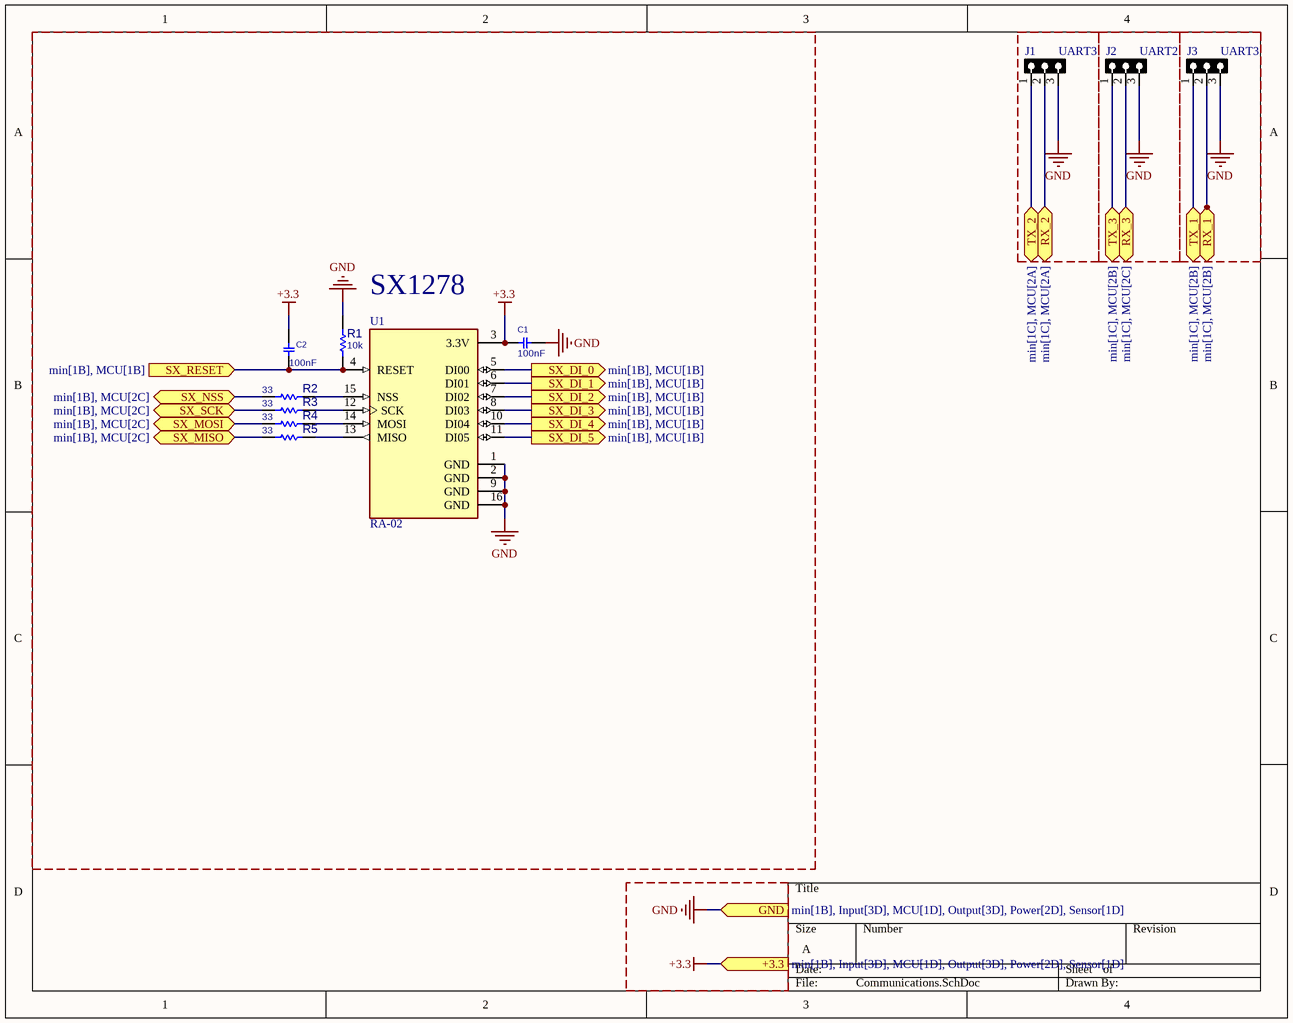
[diagram p5: Communications.SchDoc]

### Parts
C1  100nF  [C1206]
C2  100nF  [C1206]
J1  UART3  [HDR_F_1X3]
J2  UART2  [HDR_F_1X3]
J3  UART3  [HDR_F_1X3]
R1  10k  [R1206]
R2  33  [R1206]
R3  33  [R1206]
R4  33  [R1206]
R5  33  [R1206]
U1  RA-02  [RA-02]

### Ports
+3.3 (in, see min[1B], Input[3D], MCU[1D], Output[3D], Power[2D], Sensor[1D]), GND (in, see min[1B], Input[3D], MCU[1D], Output[3D], Power[2D], Sensor[1D]), RX_1 (bidir, see min[1C], MCU[2B]), RX_2 (bidir, see min[1C], MCU[2A]), RX_3 (bidir, see min[1C], MCU[2C]), SX_DI_0 (out, see min[1B], MCU[1B]), SX_DI_1 (out, see min[1B], MCU[1B]), SX_DI_2 (out, see min[1B], MCU[1B]), SX_DI_3 (out, see min[1B], MCU[1B]), SX_DI_4 (out, see min[1B], MCU[1B]), SX_DI_5 (out, see min[1B], MCU[1B]), SX_MISO (bidir, see min[1B], MCU[2C]), SX_MOSI (bidir, see min[1B], MCU[2C]), SX_NSS (bidir, see min[1B], MCU[2C]), SX_RESET (in, see min[1B], MCU[1B]), SX_SCK (bidir, see min[1B], MCU[2C]), TX_1 (bidir, see min[1C], MCU[2B]), TX_2 (bidir, see min[1C], MCU[2A]), TX_3 (bidir, see min[1C], MCU[2B])

### Nets
+3.3: C1.1 C2.1 U1.3(3.3V) ; port +3.3
GND: C1.2 J1.3 J2.3 J3.3 R1.2 U1.1(GND) U1.2(GND) U1.9(GND) U1.16(GND) ; port GND
NetC2_2: C2.2 R1.1 U1.4(RESET) ; port SX_RESET
NetJ1_1: J1.1 ; port TX_2
NetJ1_2: J1.2 ; port RX_2
NetJ2_1: J2.1 ; port TX_3
NetJ2_2: J2.2 ; port RX_3
NetJ3_1: J3.1 ; port TX_1
NetJ3_2: J3.2 ; port RX_1
NetR2_1: R2.1 ; port SX_NSS
NetR2_2: R2.2 U1.15(NSS)
NetR3_1: R3.1 ; port SX_SCK
NetR3_2: R3.2 U1.12(SCK)
NetR4_1: R4.1 ; port SX_MOSI
NetR4_2: R4.2 U1.14(MOSI)
NetR5_1: R5.1 ; port SX_MISO
NetR5_2: R5.2 U1.13(MISO)
NetU1_5: U1.5(DI00) ; port SX_DI_0
NetU1_6: U1.6(DI01) ; port SX_DI_1
NetU1_7: U1.7(DI02) ; port SX_DI_2
NetU1_8: U1.8(DI03) ; port SX_DI_3
NetU1_10: U1.10(DI04) ; port SX_DI_4
NetU1_11: U1.11(DI05) ; port SX_DI_5

### Notes on the sheet
- SX1278

### Library data of the parts
C1 C2 = CAP_SMD_MLCC: as C3 on sheet Input; PRICE: 100= 1$; ASSEMBLY: ASSEMBLY
J1-J3 = HDR_F_1X3: CONN, HEADER, Female, pitch: 2.54mm, 3POS; VALUE: HDRF3
R1-R5 = RES_SMD: RESISTOR, SMD; PARAM: -W; DESC: DESCRIPTION; DIST#: MOUSER; PARAM2: 1%; MANF_P#: -; MANF: -; ASSEMBLY: ASSEMBLY; PRICE: 100= 0.5$
U1 = RA-02: General ISM < 1GHz LoRaâ„¢ Transceiver Module 410MHz ~ 525MHz Antenna Not Included, I-PEX Surface Mount; MF: Ai-Thinker; SnapEDA_Link: https://www.snapeda.com/parts/RA-02/AI-Thinker/view-part/?ref=snap; Package: None; Value: *; MP: RA-02; Check_prices: https://www.snapeda.com/parts/RA-02/AI-Thinker/view-part/?ref=eda

## Sheet Output.SchDoc
size A; SheetNumber: 4; SheetTotal: 7
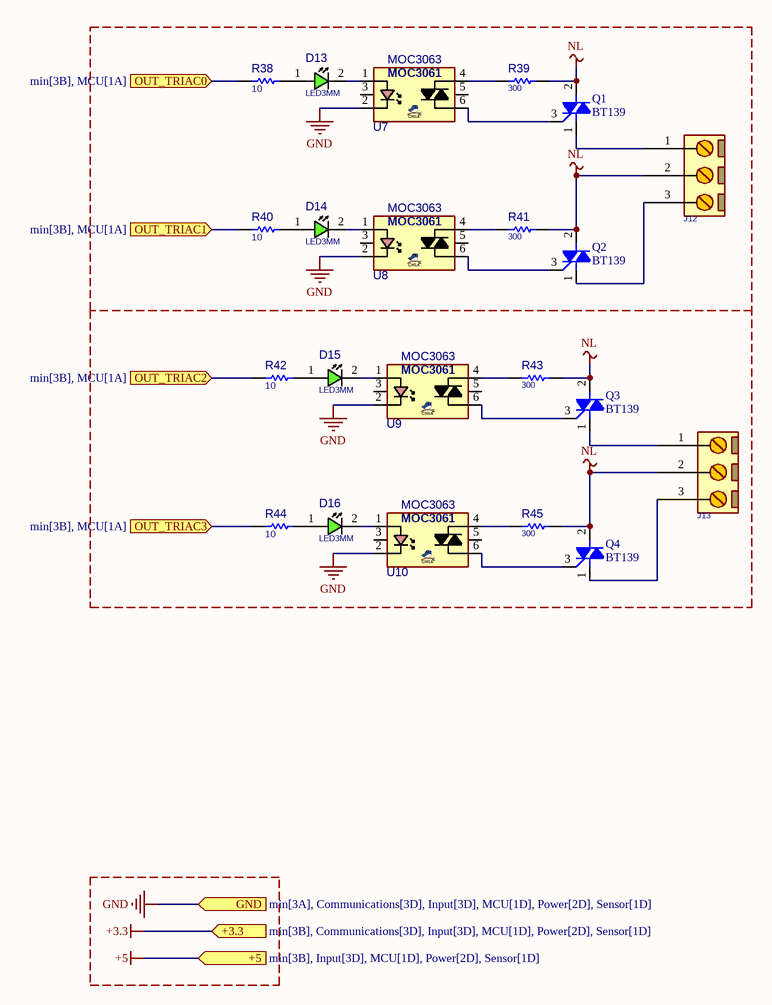
[diagram p6: Output.SchDoc]

### Parts
D13  LED3MM  [LED3MM]
D14  LED3MM  [LED3MM]
D15  LED3MM  [LED3MM]
D16  LED3MM  [LED3MM]
J12  CONN_GMSTB3  [GMSTB762_3]  (value not drawn)
J13  CONN_GMSTB3  [GMSTB762_3]  (value not drawn)
Q1  BT139  [TO220_3]
Q2  BT139  [TO220_3]
Q3  BT139  [TO220_3]
Q4  BT139  [TO220_3]
R38  10  [R1206]
R39  300  [R025W_AX_VER]
R40  10  [R1206]
R41  300  [R025W_AX_VER]
R42  10  [R1206]
R43  300  [R025W_AX_VER]
R44  10  [R1206]
R45  300  [R025W_AX_VER]
U7  MOC3063  [DIP_6]
U8  MOC3063  [DIP_6]
U9  MOC3063  [DIP_6]
U10  MOC3063  [DIP_6]

### Ports
+3.3 (in, see min[3B], Communications[3D], Input[3D], MCU[1D], Power[2D], Sensor[1D]), +5 (in, see min[3B], Input[3D], MCU[1D], Power[2D], Sensor[1D]), GND (in, see min[3A], Communications[3D], Input[3D], MCU[1D], Power[2D], Sensor[1D]), OUT_TRIAC0 (in, see min[3B], MCU[1A]), OUT_TRIAC1 (in, see min[3B], MCU[1A]), OUT_TRIAC2 (in, see min[3B], MCU[1A]), OUT_TRIAC3 (in, see min[3B], MCU[1A])

### Nets
GND: U7.2(K) U8.2(K) U9.2(K) U10.2(K) ; port GND
NL: J12.2 J13.2 Q1.2(T2) Q2.2(T2) Q3.2(T2) Q4.2(T2) R39.2 R41.2 R43.2 R45.2
NetD13_1: D13.1(ANODE) R38.2
NetD13_2: D13.2(CATHODE) U7.1(A)
NetD14_1: D14.1(ANODE) R40.2
NetD14_2: D14.2(CATHODE) U8.1(A)
NetD15_1: D15.1(ANODE) R42.2
NetD15_2: D15.2(CATHODE) U9.1(A)
NetD16_1: D16.1(ANODE) R44.2
NetD16_2: D16.2(CATHODE) U10.1(A)
NetJ12_1: J12.1 Q1.1(T1)
NetJ12_3: J12.3 Q2.1(T1)
NetJ13_1: J13.1 Q3.1(T1)
NetJ13_3: J13.3 Q4.1(T1)
NetQ1_3: Q1.3(G) U7.6(A/K)
NetQ2_3: Q2.3(G) U8.6(A/K)
NetQ3_3: Q3.3(G) U9.6(A/K)
NetQ4_3: Q4.3(G) U10.6(A/K)
NetR38_1: R38.1 ; port OUT_TRIAC0
NetR39_1: R39.1 U7.4(A/K)
NetR40_1: R40.1 ; port OUT_TRIAC1
NetR41_1: R41.1 U8.4(A/K)
NetR42_1: R42.1 ; port OUT_TRIAC2
NetR43_1: R43.1 U9.4(A/K)
NetR44_1: R44.1 ; port OUT_TRIAC3
NetR45_1: R45.1 U10.4(A/K)

Not connected (* = marked no-connect by the designer): U7 3(NC) 5(NC); U8 3(NC) 5(NC); U9 3(NC) 5(NC); U10 3(NC) 5(NC)

### Library data of the parts
D13-D16 = LED_THD_3MM: LED, THD, 3MM, GREEN; DESC: DESCRIPTION; MANF_P#: MANF_PART#; PARAM2: 2.2V; MANF: MANF; ASSEMBLY: ASSEMBLY; PRICE: PRICE; VALUE: LED3MM
J12 J13 = CONN_GMSTB762_3: CONN, PHOENIX MSTB, 5-G, 5.08mm pitch; MANF_P#: GMSTB 2,5/3-G-7,62; PARAM2: 630V; PARAM: 12A; VALUE: CONN_GMSTB3
Q1-Q4 = TRIAC: Triac, 600V, 4A, TO-220, Silicon Bidirectional Thyristor; VALUE: BT136; MANF_P#: *; MANF: *; PRICE: toman@PAYA
R38 R40 R42 R44 = RES_SMD: as R6 on sheet Input; MANF_P#: -; MANF: -; ASSEMBLY: ASSEMBLY; PRICE: 100= 0.5$
R39 R41 R43 R45 = RES_THD: RESISTOR, THD; MANF_P#: RK73H1ETTP4701F; MANF: KOA SPEER; PARAM: 0.063W; DESC: DESCRIPTION; DIST#: MOUSER; PARAM2: 1%; ASSEMBLY: ASSEMBLY; PRICE: 100= 0.5$; VALUE: 300
U7-U10 = OPT_TRIAC6P_MOC3061: OPTOTRIAC, 600v/1A, 6v In; PARAM2: 300mW, -40~85°C; PARAM: 6v/60mA IN/ 600v/1A out; MANF_P#: MOC3061; PRICE: 5t@paya; VALUE: MOC3061; PACKAGE: DIP-6

## Nets that join several sheets
+3.3: Power (12 pins), MCU (5 pins), Communications (C1.1 C2.1 U1.3)
+5: Input (12 pins), Sensor (J15.1 J16.1 U11.3), MCU (R62.2)
GND: Input (32 pins), Power (26 pins), Sensor (11 pins), MCU (13 pins), Communications (9 pins), Output (U7.2 U8.2 U9.2 U10.2)
NetC10_1: Sensor (C10.1 R57.1), MCU (U13.17)
NetC11_1: Sensor (C11.1 R58.1), MCU (U13.16)
NetC12_2: Sensor (C12.2 R60.1), MCU (U13.10)
NetD2_2: Input (D2.2 R11.2), MCU (U13.19)
NetD6_2: Input (D6.2 R20.2), MCU (U13.18)
NetD26_2: Sensor (D26.2 R59.2), MCU (U13.11)
NetJ1_1: MCU (U13.12), Communications (J1.1)
NetJ1_2: MCU (U13.13), Communications (J1.2)
NetJ2_1: MCU (U13.21), Communications (J2.1)
NetJ2_2: MCU (U13.22), Communications (J2.2)
NetJ3_1: MCU (U13.30), Communications (J3.1)
NetJ3_2: MCU (U13.31), Communications (J3.2)
NetR2_1: MCU (U13.25), Communications (R2.1)
NetR3_1: MCU (U13.26), Communications (R3.1)
NetR4_1: MCU (U13.28), Communications (R4.1)
NetR5_1: MCU (U13.27), Communications (R5.1)